# EAGLE design 5OR_1 (EAGLE 6.5.0)
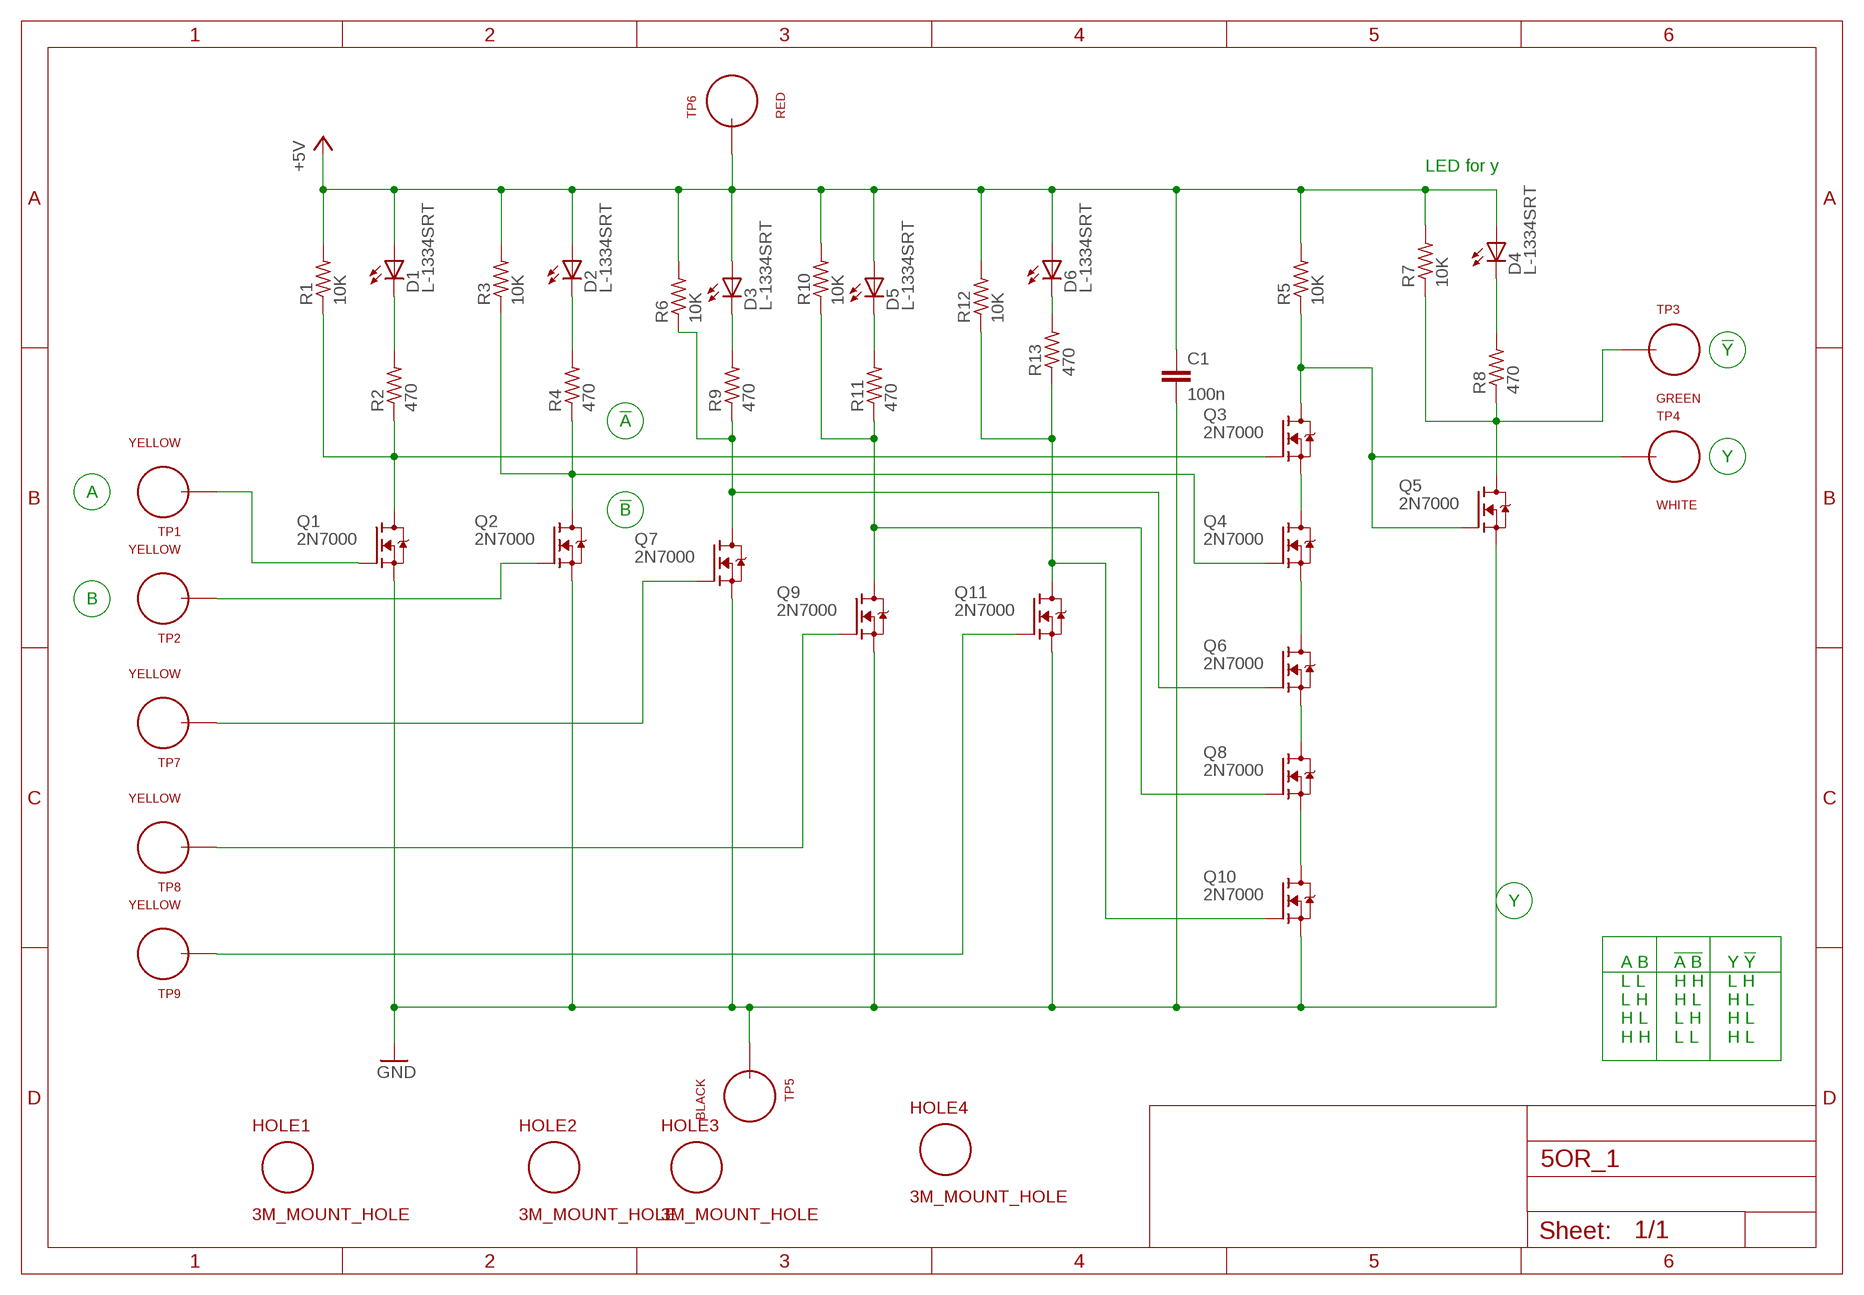
[diagram p0: schematic, sheet 1]

## Parts
C1  100n  C_P2INCH  [CAP_P2INCH]
D1  L-1334SRT  [LED3MM]
D2  L-1334SRT  [LED3MM]
D3  L-1334SRT  [LED3MM]
D4  L-1334SRT  [LED3MM]
D5  L-1334SRT  [LED3MM]
D6  L-1334SRT  [LED3MM]
HOLE1  3M_MOUNT_HOLE  [3M_HOLE]
HOLE2  3M_MOUNT_HOLE  [3M_HOLE]
HOLE3  3M_MOUNT_HOLE  [3M_HOLE]
HOLE4  3M_MOUNT_HOLE  [3M_HOLE]
Q1  2N7000  [TO92-DGS]
Q2  2N7000  [TO92-DGS]
Q3  2N7000  [TO92-DGS]
Q4  2N7000  [TO92-DGS]
Q5  2N7000  [TO92-DGS]
Q6  2N7000  [TO92-DGS]
Q7  2N7000  [TO92-DGS]
Q8  2N7000  [TO92-DGS]
Q9  2N7000  [TO92-DGS]
Q10  2N7000  [TO92-DGS]
Q11  2N7000  [TO92-DGS]
R1  10K  R_P2INCH  [R_P2INCH]
R2  470  R_P2INCH  [R_P2INCH]
R3  10K  R_P2INCH  [R_P2INCH]
R4  470  R_P2INCH  [R_P2INCH]
R5  10K  R_P2INCH  [R_P2INCH]
R6  10K  R_P2INCH  [R_P2INCH]
R7  10K  R_P2INCH  [R_P2INCH]
R8  470  R_P2INCH  [R_P2INCH]
R9  470  R_P2INCH  [R_P2INCH]
R10  10K  R_P2INCH  [R_P2INCH]
R11  470  R_P2INCH  [R_P2INCH]
R12  10K  R_P2INCH  [R_P2INCH]
R13  470  R_P2INCH  [R_P2INCH]
TP1  YELLOW  TEST_LOOP  [TEST_LOOP]
TP2  YELLOW  TEST_LOOP  [TEST_LOOP]
TP3  GREEN  TEST_LOOP  [TEST_LOOP]
TP4  WHITE  TEST_LOOP  [TEST_LOOP]
TP5  BLACK  TEST_LOOP  [TEST_LOOP]
TP6  RED  TEST_LOOP  [TEST_LOOP]
TP7  YELLOW  TEST_LOOP  [TEST_LOOP]
TP8  YELLOW  TEST_LOOP  [TEST_LOOP]
TP9  YELLOW  TEST_LOOP  [TEST_LOOP]

## Nets
+5V: C1.1 D1.A D2.A D3.A D4.A D5.A D6.A R1.2 R3.2 R5.2 R6.2 R7.2 R10.2 R12.2 TP6.P$1
GND: C1.2 Q1.S Q2.S Q5.S Q7.S Q9.S Q10.S Q11.S TP5.P$1
N$1: Q3.D Q5.G R5.1 TP4.P$1
N$2: Q3.S Q4.D
N$3: D4.K(C) R8.2
N$4: Q5.D R7.1 R8.1 TP3.P$1
N$5: Q4.S Q6.D
N$6: D2.K(C) R4.2
N$7: Q2.D Q4.G R3.1 R4.1
N$8: D1.K(C) R2.2
N$9: Q1.D Q3.G R1.1 R2.1
N$10: D3.K(C) R9.2
N$11: Q1.G TP1.P$1
N$12: Q2.G TP2.P$1
N$13: Q6.G Q7.D R6.1 R9.1
N$16: Q7.G TP7.P$1
N$17: Q6.S Q8.D
N$18: D5.K(C) R11.2
N$19: Q8.G Q9.D R10.1 R11.1
N$20: Q9.G TP8.P$1
N$21: D6.K(C) R13.2
N$22: Q10.G Q11.D R12.1 R13.1
N$23: Q8.S Q10.D
N$24: Q11.G TP9.P$1

## Notes on the sheet
- LED for y
- !Y
- !A
- Y
- A
- !B
- B
- Y
- A B
  L L
  L H
  H L
  H H
- !A B
  H H
  H L
  L H
  L L
- Y !Y
  L H
  H L
  H L
  H L

## Library data of the parts
C1 = MyLib:C_P2INCH
D1-D6 = MyLib:L-1334SRT
HOLE1-HOLE4 = MyLib:3M_MOUNT_HOLE
Q1-Q11 = MyLib:2N7000
R1-R13 = MyLib:R_P2INCH
TP1-TP9 = MyLib:TEST_LOOP

## Board
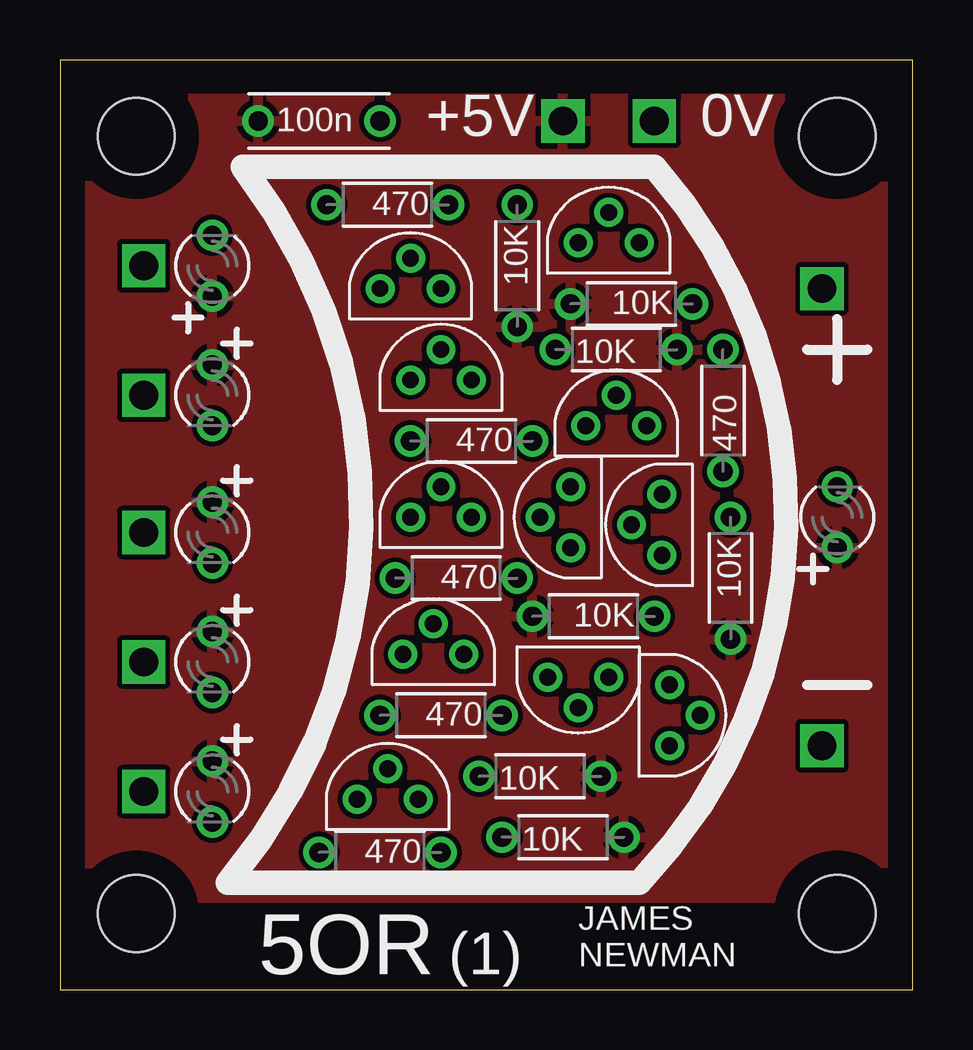
[diagram p1: board, top side]
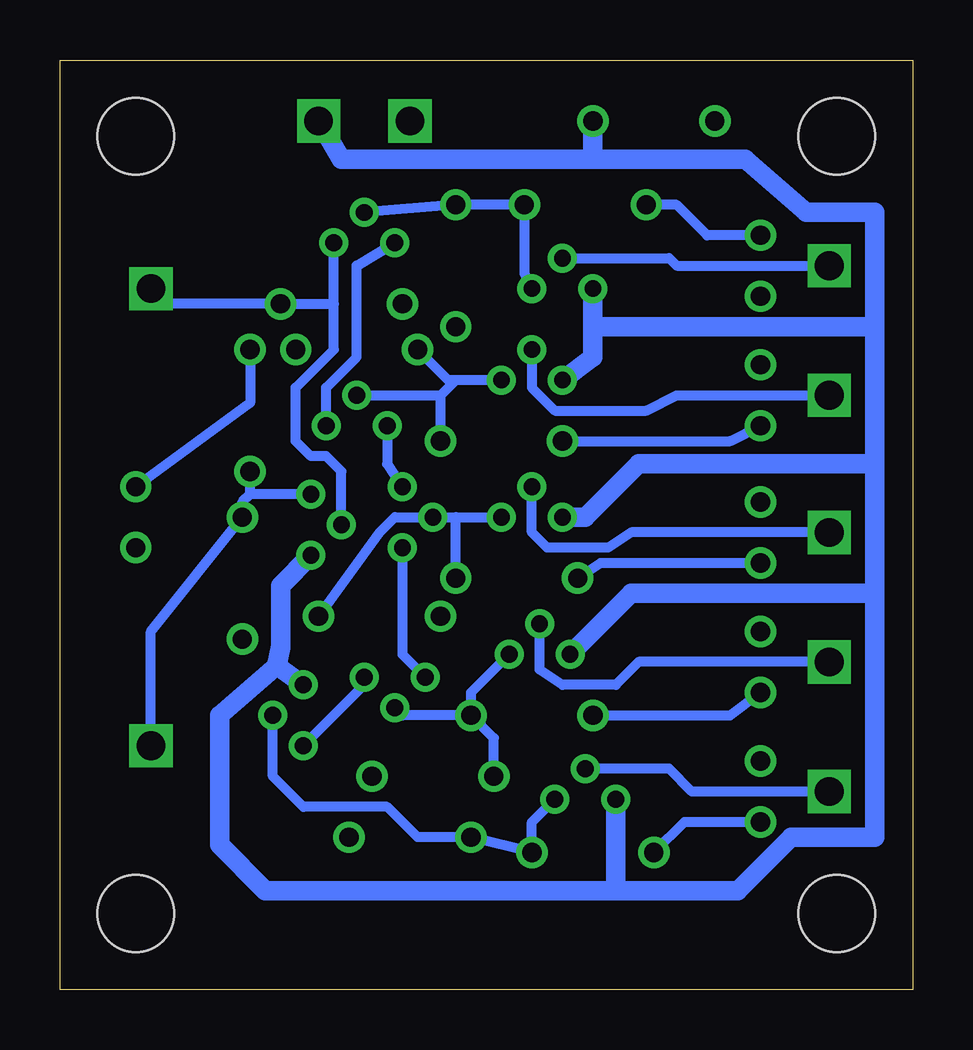
[diagram p2: board, bottom side, seen from below]

Size 35.54 x 38.73 mm. Coordinates in mm from the lower left corner, seen from the top.
Outline: 0,0 35.54,0 35.54,38.73 0,38.73 0,0
Copper layers (1*16): Top 0.035mm / dielectric 1.5mm / Bottom 0.035mm
Design rules "processor_rules *": minimum track width 10mil, minimum drill 0.0236mm, track to track 8mil, track to pad 8mil, pad to pad 8mil, via to via 8mil, smd to smd 8mil, copper to edge 40mil, drill to drill 8mil, minimum pad ring 10mil, minimum via ring 8mil, stop-mask expansion 4mil, vias tented up to drill 0.7mm, thermal gap 10mil

### Footprints (pad centres in the part's own frame; a part is rotated, then mirrored left to right if it is on the bottom)
CAP_P2INCH = drill 0.8: 1 -2.54,0; 2 2.54,0
LED3MM = drill 0.8: A -1.27,0; K 1.27,0
3M_HOLE = hole 3.2: 0,0
TO92-DGS = drill 0.7: D 0,1.27; G -1.27,0; S 0,-1.27
R_P2INCH = drill 0.8: 1 -2.54,0; 2 2.54,0
TEST_LOOP = drill 1.2 square: P$1 0,0

### Placement (x,y rotation side)
C1  10.79,36.2 0 top
D1  6.35,30.16 90 top
D2  6.35,24.77 270 top
D3  6.35,19.05 270 top
D4  32.38,19.68 90 top
D5  6.35,13.65 270 top
D6  6.35,8.26 270 top
HOLE1  3.17,3.17 0 top
HOLE2  3.17,35.56 0 top
HOLE3  32.38,3.17 0 top
HOLE4  32.38,35.56 0 top
Q1  14.61,29.21 270 top
Q2  15.88,25.4 270 top
Q3  22.86,31.11 270 top
Q4  23.18,23.5 270 top
Q5  25.08,19.37 0 top
Q6  21.27,19.68 0 top
Q7  15.88,19.68 270 top
Q8  21.59,13.02 90 top
Q9  15.56,13.97 270 top
Q10  25.4,11.43 180 top
Q11  13.65,7.94 270 top
R1  19.05,30.16 270 top
R2  13.65,32.7 180 top
R3  23.18,26.67 0 top
R4  17.14,22.86 180 top
R5  23.81,28.57 180 top
R6  22.23,15.56 180 top
R7  27.94,17.14 270 top
R8  27.62,24.13 90 top
R9  16.51,17.14 180 top
R10  20,8.89 0 top
R11  15.88,11.43 180 top
R12  20.95,6.35 0 top
R13  13.34,5.71 180 top
TP1  3.49,30.16 0 top
TP2  3.49,24.77 0 top
TP3  31.75,10.16 0 top
TP4  31.75,29.21 0 top
TP5  24.77,36.2 0 top
TP6  20.95,36.2 0 top
TP7  3.49,19.05 0 top
TP8  3.49,13.65 0 top
TP9  3.49,8.26 0 top

### Tracks (layer width: path | path; a pad name or v marks a point on that pad's centre or on a via)
+5V
  pour Top: 1.27,37.15 34.29,37.15 34.29,3.81 1.27,3.81
GND
  Bottom 0.813: TP5.P$1 23.81,34.61 13.34,34.61 | 13.34,34.61 6.99,34.61 4.45,32.38 1.59,32.38 1.59,27.62 | Q2.S 13.34,26.35 13.34,27.62 | 13.34,27.62 1.59,27.62 | 13.34,27.62 Q1.S | Q7.S 13.65,19.68 11.43,21.91 1.59,21.91 | Q5.S 26.35,16.83 26.35,14.29 26.51,13.49 | 1.59,27.62 1.59,21.91 | 1.59,21.91 1.59,16.51 | 1.59,16.51 1.59,6.35 5.08,6.35 7.3,4.13 12.38,4.13 | C1.2 13.34,34.61 | Q9.S 11.75,16.51 1.59,16.51 | Q11.S 12.38,4.13 | 12.38,4.13 26.99,4.13 28.89,6.03 28.89,11.43 26.51,13.49 | 26.51,13.49 Q10.S
N$1
  Bottom 0.406: Q5.G 23.81,21.59 24.45,22.23 25.08,22.23 25.72,22.86 25.72,25.08 24.13,26.67 24.13,28.57 | 24.13,28.57 Q3.D | 24.13,28.57 R5.1 31.11,28.57 TP4.P$1
N$2
  Bottom 0.406: Q4.D 24.45,25.08 23.18,26.35 23.18,30.16 Q3.S
N$3
  Bottom 0.406: R8.2 27.62,24.45 D4.K
N$4
  Bottom 0.406: TP3.P$1 31.75,14.92 R7.1 27.94,20.32 27.62,20.64 | Q5.D 27.62,20.64 | 27.62,20.64 R8.1
N$5
  Bottom 0.406: Q4.S 21.91,21.91 Q6.D
N$6
  Bottom 0.406: R4.2 7.62,22.86 D2.K
N$7
  Bottom 0.406: Q2.D 19.05,25.4 | 19.05,25.4 19.37,25.4 R3.1 | R4.1 19.68,24.77 | 19.68,24.77 19.05,25.4 | Q4.G 19.68,24.77
N$8
  Bottom 0.406: D1.K 8.57,31.43 9.84,32.7 R2.2
N$9
  Bottom 0.406: Q1.D 16.19,29.84 R2.1 R1.1 Q3.G
N$10
  Bottom 0.406: R9.2 13.02,17.78 D3.K
N$11
  Bottom 0.406: Q1.G 10.16,30.48 9.84,30.16 TP1.P$1
N$12
  Bottom 0.406: Q2.G 15.88,25.08 14.92,24.13 11.11,24.13 9.84,24.77 TP2.P$1
N$13
  Bottom 0.406: R6.1 22.23,19.05 21.59,19.68 Q6.G 19.05,19.68 | 19.05,19.68 Q7.D | R9.1 19.05,19.68
N$16
  Bottom 0.406: TP7.P$1 11.75,19.05 12.7,18.41 15.24,18.41 15.88,19.05 Q7.G
N$17
  Bottom 0.406: Q6.S 21.27,13.97 Q8.D
N$18
  Bottom 0.406: R11.2 7.62,11.43 D5.K
N$19
  Bottom 0.406: R11.1 18.41,12.38 Q9.D | R11.1 21.27,11.43 Q8.G | R10.1 17.46,10.48 R11.1
N$20
  Bottom 0.406: TP8.P$1 11.43,13.65 12.38,12.7 14.61,12.7 15.56,13.34 Q9.G
N$21
  Bottom 0.406: D6.K 9.53,6.99 R13.2
N$22
  Bottom 0.406: Q11.D 15.88,6.99 R13.1 R12.1 20.64,6.35 21.91,7.62 25.4,7.62 26.67,8.89 Q10.G
N$23
  Bottom 0.406: Q8.S 22.86,12.7 Q10.D
N$24
  Bottom 0.406: TP9.P$1 9.21,8.26 10.16,9.21 Q11.G

### Text on the board
tPlace: +5V | 0V | 5OR | (1) | JAMES / NEWMAN